# Altium schematic sheet RS-485.SchDoc: RS-485
size A3; Author: A.Horvath; Organization: Reichle & De-Massari; Address1: Binzstrasse 32; Address2: 8620 Wetzikon; Address3: Switzerland; DocumentNumber: 5; Revision: 0.1V; SheetNumber: 5; SheetTotal: 11
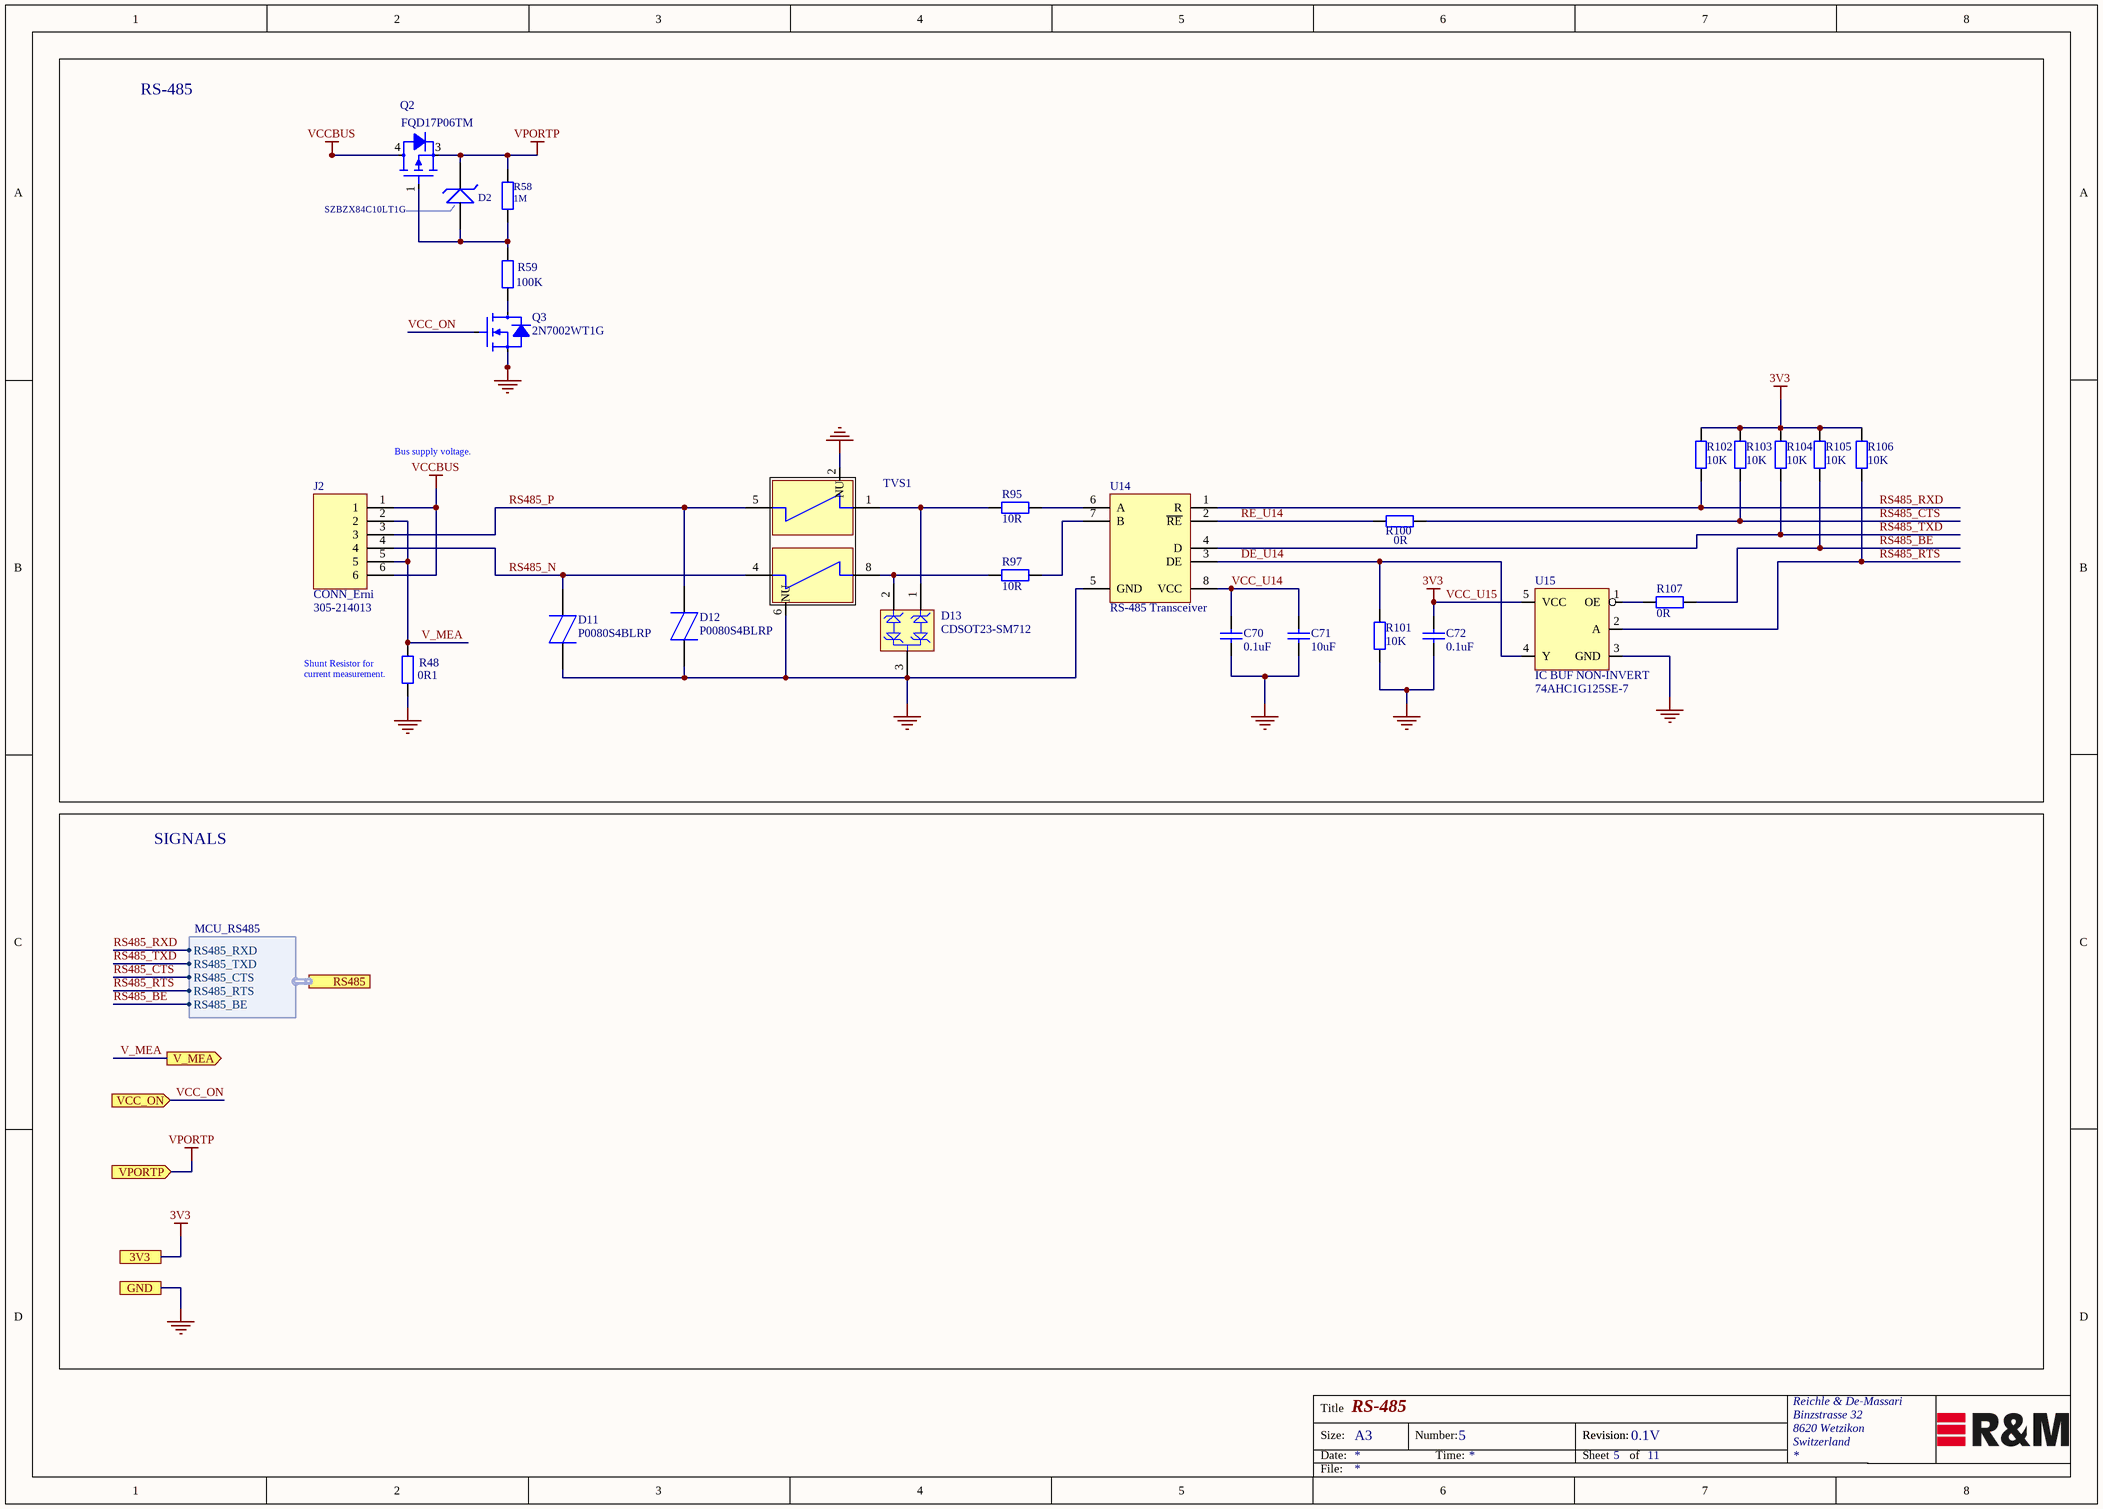
[diagram p0: RS-485.SchDoc]

## Parts
C70  0.1uF  [Ceramic Capacitor 0402 EIA]
C71  10uF  [Ceramic Capacitor 0402 EIA]
C72  0.1uF  [Ceramic Capacitor 0402 EIA]
D2  SZBZX84C10LT1G  [SOT-23_BZX84]
D11  P0080S4BLRP  [P0080S4BLRP]
D12  P0080S4BLRP  [P0080S4BLRP]
D13  CDSOT23-SM712  [BOUR-SOT23-3_V]
J2  CONN_Erni  Supplier Part Number 1: 305-214013  [ERNI_214013 Randmontage_6_R]
Q2  FQD17P06TM  [DPAK_FQU17P06]
Q3  2N7002WT1G  [SOT323_2N7002WT1G]
R48  0R1  [Resistor 4527]
R58  1M  [Resistor 0402 EIA]
R59  100K  [Resistor 0402 EIA]
R95  10R  [Resistor 0603 EIA]
R97  10R  [Resistor 0603 EIA]
R100  0R  [Resistor 0402 EIA]
R101  10K  [Resistor 0402 EIA]
R102  10K  [Resistor 0402 EIA]
R103  10K  [Resistor 0402 EIA]
R104  10K  [Resistor 0402 EIA]
R105  10K  [Resistor 0402 EIA]
R106  10K  [Resistor 0402 EIA]
R107  0R  [Resistor 0402 EIA]
TVS1  TBU-CA065-200-WH  [Bourns_TBU_PL060_WH]  (value not drawn)
U14  RS-485 Transceiver  [TI_D (R-PDSO-G8)_8_R]
U15  IC BUF NON-INVERT  [SOT353]

## Blocks framed on the sheet
RS-485: C70-C72 D2 D11-D13 J2 Q2 Q3 R48 R58 R59 R95 R97 R100-R107 TVS1 U14 U15

## Ports
3V3, GND, RS485 (harness MCU_RS485), V_MEA (out), VCC_ON (in), VPORTP (in)

## Harnesses
MCU_RS485: RS485_RXD, RS485_CTS, RS485_TXD, RS485_BE, RS485_RTS

## Nets
GND: C70.1 C71.1 C72.1 D11.1(A) D12.1(A) D13.3 Q3.2 R48.2 R101.2 TVS1.2(NU) TVS1.6(NU) U14.5(GND) U15.3(GND) ; port GND
VCC_U15: C72.2 R102.1 R103.1 R104.1 R105.1 R106.1 U15.5(VCC) ; port 3V3  [also labelled 3V3]
VCCBUS: J2.1 J2.6 Q2.4
VPORTP: D2.3(K) Q2.3 R58.1 ; port VPORTP
DE_U14: R101.1 U14.3(DE) U15.4(Y)
RE_U14: R100.1 U14.2(~{RE})
RS485_BE: R105.2 R107.2 ; port RS485.RS485_BE
RS485_CTS: R100.2 R103.2 ; port RS485.RS485_CTS
RS485_N: D11.2(K) J2.4 TVS1.4
RS485_P: D12.2(K) J2.3 TVS1.5
RS485_RTS: R106.2 U15.2(A) ; port RS485.RS485_RTS
RS485_RXD: R102.2 U14.1(R) ; port RS485.RS485_RXD
RS485_TXD: R104.2 U14.4(D) ; port RS485.RS485_TXD
V_MEA: J2.2 J2.5 R48.1 ; port V_MEA
VCC_ON: Q3.1 ; port VCC_ON
VCC_U14: C70.2 C71.2 U14.8(VCC)
NetD2_1: D2.1(A) Q2.1 R58.2 R59.1
NetD13_1: D13.1 R95.1 TVS1.1
NetD13_2: D13.2 R97.1 TVS1.8
NetQ3_3: Q3.3 R59.2
NetR95_2: R95.2 U14.6(A)
NetR97_2: R97.2 U14.7(B)
NetR107_1: R107.1 U15.1(OE)

## Notes on the sheet
- Bus supply voltage.
- (near R48) Shunt Resistor for current measurement.
- SIGNALS
- Title
- Size:
- Date:
- A3
- Number:
- Time:
- Revision:
- Sheet
- of
- File:

## Library data of the parts
C70 C72 = Cap_0.1uF_0402_10V: 0.1µF ±20% 10V Ceramic Capacitor X5R 0402 (1005 Metric); Manufacturer: Wurth Electronics; Manufacturer PartNr: 885012105010; voltage: 10VDC; Replaceable: yes; value: 0.1uF; tolerance: 20%; Footprint/Package: 0402; Dielectric Grade: X5R; ComponentLink1Description: mouser; ComponentLink1URL: https://www.mouser.ch/ProductDetail/Wurth-Electronics/885012105010?qs=sGAEpiMZZMs0AnBnWHyRQEGbLOF2VP1ihL84oCjXnlO407YOHi%2fQbw%3d%3d; Supplier 1: Digi-Key; Supplier 2: Farnell; Supplier 3: Mouser; Supplier Part Number 3: 710-885012105010; Supplier Part Number 2: 2533928; Supplier Part Number 1: 732-7487-1-ND
C71 = Cap_10uF_0402_10V: 10µF ±20% 10V Ceramic Capacitor X5R 0402 (1005 Metric); Manufacturer: Samsung Electro-Mechanics; Manufacturer PartNr: CL05A106MP8NUB8; voltage: 10VDC; Replaceable: yes; value: 10uF; tolerance: 20%; ComponentLink1Description: mouser; ComponentLink1URL: https://www.mouser.ch/ProductDetail/Murata-Electronics/ZRB15XR61A106ME01D?qs=sGAEpiMZZMs0AnBnWHyRQN7%2fAA2D2lPPC0%2fdyv23S%2fU%252bBeuYI5b1UA%3d%3d; Footprint/Package: 0402 (1005 metric); Dielectric Grade: X5R; Supplier 1: Digi-Key; Supplier Part Number 1: 1276-6830-1-ND
D2 = Diode_SZBZX84C10LT1G: Zener Diode 10V 225mW ±6% Oberflächenmontage SOT-23-3 (TO-236); Manufacturer: ON Semiconductor; Replaceable: no; Manufacturer PartNr: SZBZX84C10LT1G; Footprint/Package: SOT-23-3 (TO-236); Supplier 1: Digi-Key; Supplier Part Number 1: SZBZX84C10LT1GOSDKR-ND; power: 225mW; value: SZBZX84C10LT1G; voltage: 10V
D11 D12 = P0080S4BLRP: Thyristor Surge Protection Devices (TSPD) PxxxxS4xLRP Series SIDACtor Protection Thyristor 100A 25V Bi SOD; Manufacturer: Littelfuse; Replaceable: no; ComponentLink1Description: mouser; ComponentLink1URL: https://www.mouser.ch/ProductDetail/Diodes-Incorporated/DESD3V3S1BL-7B?qs=%2fha2pyFaduhA707awRoRgtNXj1BWecNQPXz8CtVYm9O48rqwfwJI0g%3d%3d; Footprint/Package: SOD-123FL; Supplier 1: Mouser; Supplier Part Number 1: 576-P0080S4BLRP; Supplier 2: Digikey; Supplier Part Number 2: P0080S4BLRPCT-ND; Manufacturer PartNr: P0080S4BLRP
D13 = Diode_TVS_26V: TVSDiode, 26V, 14V Clamp 17A (8/20µs) Ipp, Surface Mount SOT-23-3, Applications RS-485; Manufacturer: Bourns; power: 400W; Replaceable: no; Dielectric Grade: NA; Supplier 1: Digi-Key; Package / Case: TO-236-3,SC-59,SOT-23-3; Supplier Part Number 1: CDSOT23-SM712CT-ND; voltage: 26V, 14V; value: CDSOT23-SM712; Footprint/Package: DO-214AC-2 (SMA); Manufacturer PartNr: CDSOT23-SM712
J2 = CONN_Erni_6_214013: Headers & Wire Housings 6P 1.27MM SNGL ROW R/A MALE BLK; Manufacturer: ERNI; Manufacturer PartNr: 214013; Replaceable: no; Footprint/Package: 1.27mm; ComponentLink1Description: mouser; ComponentLink1URL: https://www.mouser.ch/ProductDetail/ERNI/214013?qs=sGAEpiMZZMvMXbh32ZmHAMhEPQG9jaj7Ou3J%2fuOb4IQ%3d; Supplier 1: Mouser
Q2 = FQD17P06TM: P-Channel 60V 12A (Tc) 2.5W (Ta), 44W (Tc) Surface Mount D-Pak; Manufacturer: ON Semiconductor; tolerance: NA; Replaceable: no; value: FQD17P06TM; voltage: 60V; Manufacturer PartNr: FQD17P06TM; Footprint/Package: TO-252-3, DPak; Dielectric Grade: NA; ComponentLink1Description: mouser; ComponentLink1URL: https://www.mouser.ch/ProductDetail/Murata-Electronics/GCM155C71A105KE38D?qs=sGAEpiMZZMsh%252b1woXyUXj0FEAttKcN54ouz5zO04smg%3d; Supplier Part Number 1: FQD17P06TMCT-ND; Supplier 1: Digi-Key; power: 2.5W
Q3 = 2N7002WT1G: N-Channel 60V 310mA (Ta) 280mW (Tj) Surface Mount SC-70-3 (SOT323); Manufacturer: ON Semiconductor; tolerance: NA; Replaceable: no; value: 2N7002WT1G; voltage: 60V; Manufacturer PartNr: 2N7002WT1G; Footprint/Package: SC-70, SOT-323; Dielectric Grade: NA; ComponentLink1Description: mouser; ComponentLink1URL: https://www.mouser.ch/ProductDetail/Murata-Electronics/GCM155C71A105KE38D?qs=sGAEpiMZZMsh%252b1woXyUXj0FEAttKcN54ouz5zO04smg%3d; Supplier Part Number 1: 2N7002WT1GOSCT-ND; Supplier 1: Digi-Key; power: 280mW
R48 = Res_0R1: 100 mOhms ±1% 5W Chip Resistor 4527 J-Lead Anti-Sulfur, Automotive AEC-Q200, Current Sense, Moisture Resistant; Manufacturer: Vishay / Dale; Manufacturer PartNr: WSR5R1000FEA; Replaceable: no; value: 0R1; tolerance: ±1%; power: 5W; Footprint/Package: 4527 (11570 metric); Supplier 1: Digi-Key; Supplier Part Number 1: WSRC-.1CT-ND
R58 = Res_1M_0402: 1 MOhms ±1% 0.1W, 1/10W Chip Resistor 0402 (1005 Metric) Anti-Sulfur Thin Film; Manufacturer: Vishay Beyschlag; Manufacturer PartNr: MCS04020C1004FE000; Replaceable: yes; Supplier 1: Digi-Key; Supplier Part Number 1: MCS0402-1.00M-CFCT-ND; Footprint/Package: 0402 (1005 metric); value: 1M; power: 0.1W, 1/10W; tolerance: ±1%; Dielectric Grade: -
R59 = Res_100K_0402: 100 kOhms ±0,1% 0,063W, 1/16W Chip-Widerstand 0402 (1005 metrisch) Dünnschicht; Manufacturer: Yageo; Manufacturer PartNr: RT0402BRD07100KL; tolerance: ±0.1%; Replaceable: yes; value: 100K; power: 0,063W, 1/16W; Footprint/Package: 0402 (1005 metrisch); Supplier 1: Digi-Key; Supplier Part Number 1: YAG1343CT-ND
R95 R97 = Res_10R_0603: SMD 1/4watt 10ohms 1%; Manufacturer: Vishay; Manufacturer PartNr: CRCW060310R0FKEAHP; power: 250mW; Replaceable: yes; value: 10R; tolerance: 1%; Footprint/Package: 0603 (1608 metric); Supplier 1: Digi-Key; Supplier 2: Mouser; Supplier Part Number 2: CRCW060310R0FKEAHP; Supplier Part Number 1: 541-10.0SCT-ND
R100 R107 = Res_0R_0402: 0 Ohms Resistor 0402; Manufacturer: Panasonic Electronic Components; Manufacturer PartNr: ERJ-2GE0R00X; power: 100mW; Replaceable: yes; value: 0R; tolerance: -; Footprint/Package: 0402 (1005 metric); Supplier 1: Digi-Key; Supplier Part Number 1: P0.0JCT-ND
R101-R106 = Res_10K_0402: SMD 10K ohm 1% 50V General Purpose; Manufacturer: Yageo; Manufacturer PartNr: RC0402FR-1010KL; power: 63mW; Replaceable: yes; value: 10K; tolerance: 1%; ComponentLink1Description: mouser; ComponentLink1URL: https://www.mouser.ch/ProductDetail/Yageo/RC0402FR-1010KL?qs=sGAEpiMZZMtlubZbdhIBIEgN9MQql2m6Sb2LnYlCICU%3d; Footprint/Package: 0402; Supplier 1: Mouser; Supplier Part Number 1: 603-RC0402FR-1010KL; Supplier 2: Digi-Key; Supplier Part Number 2: *
TVS1 = Bourns_TBU-PL060-200-WH: TBU-PL Series dual 50 ohm Surge Suppressors, bi-directional; Manufacturer: Bourns; Replaceable: no; voltage: 350V; power: NA; Manufacturer PartNr: TBU-PL060-200-WH; Supplier 1: Mouser; Footprint/Package: DFN; Supplier Part Number 1: 652-TBU-PL060-200-WH; value: TBU-PL060-200-WH; Dielectric Grade: NA
U14 = SN65HVD11DR: RS-485 Interface IC 3.3V Differential Transceivers; Manufacturer: Texas Instruments; Replaceable: no; Manufacturer PartNr: SN65HVD11DR; ComponentLink1Description: mouser; ComponentLink1URL: https://www.mouser.ch/ProductDetail/Texas-Instruments/SN65HVD11DR?qs=sGAEpiMZZMtk5jbcouIbS2cUqarwnJ3LOIItPoxnG4E%3d; Footprint/Package: SOIC-8; Supplier 1: Digi-Key; Supplier 2: Farnell; Supplier 3: Mouser; Supplier Part Number 1: 296-31717-6-ND; Supplier Part Number 2: 2436743; Supplier Part Number 3: 595-SN65HVD11DR
U15 = 74AHC1G125SE-7: Buffer, Non-Inverting 1 Element 1 Bit per Element 3-State Output SOT-353; Manufacturer: Diodes Incorporated; Replaceable: no; Footprint/Package: SOT353; ComponentLink1Description: mouser; ComponentLink1URL: https://www.mouser.ch/ProductDetail/Samtec/BBL-103-G-E?qs=sGAEpiMZZMs%252bGHln7q6pm5ZHNJhTjtr3eyJKd0ZImQM%3d; Supplier 2: Mouser; Supplier 1: Digi-Key; Supplier 3: Farnell; Supplier Part Number 1: SAM1104-03-ND; Supplier Part Number 2: 200-SL103G12; Supplier Part Number 3: 2019491; Manufacturer PartNr: 74AHC1G125SE-7